# Altium schematic sheet pca10156_sheet4_level_shifters.SchDoc: =BoardTitle+' - Level Shifters'
size A3; Organization: Nordic Semiconductor; DocumentNumber: 4; SheetNumber: 4; SheetTotal: 8; CompanyName: Nordic Semiconductor; DocumentSize: A4
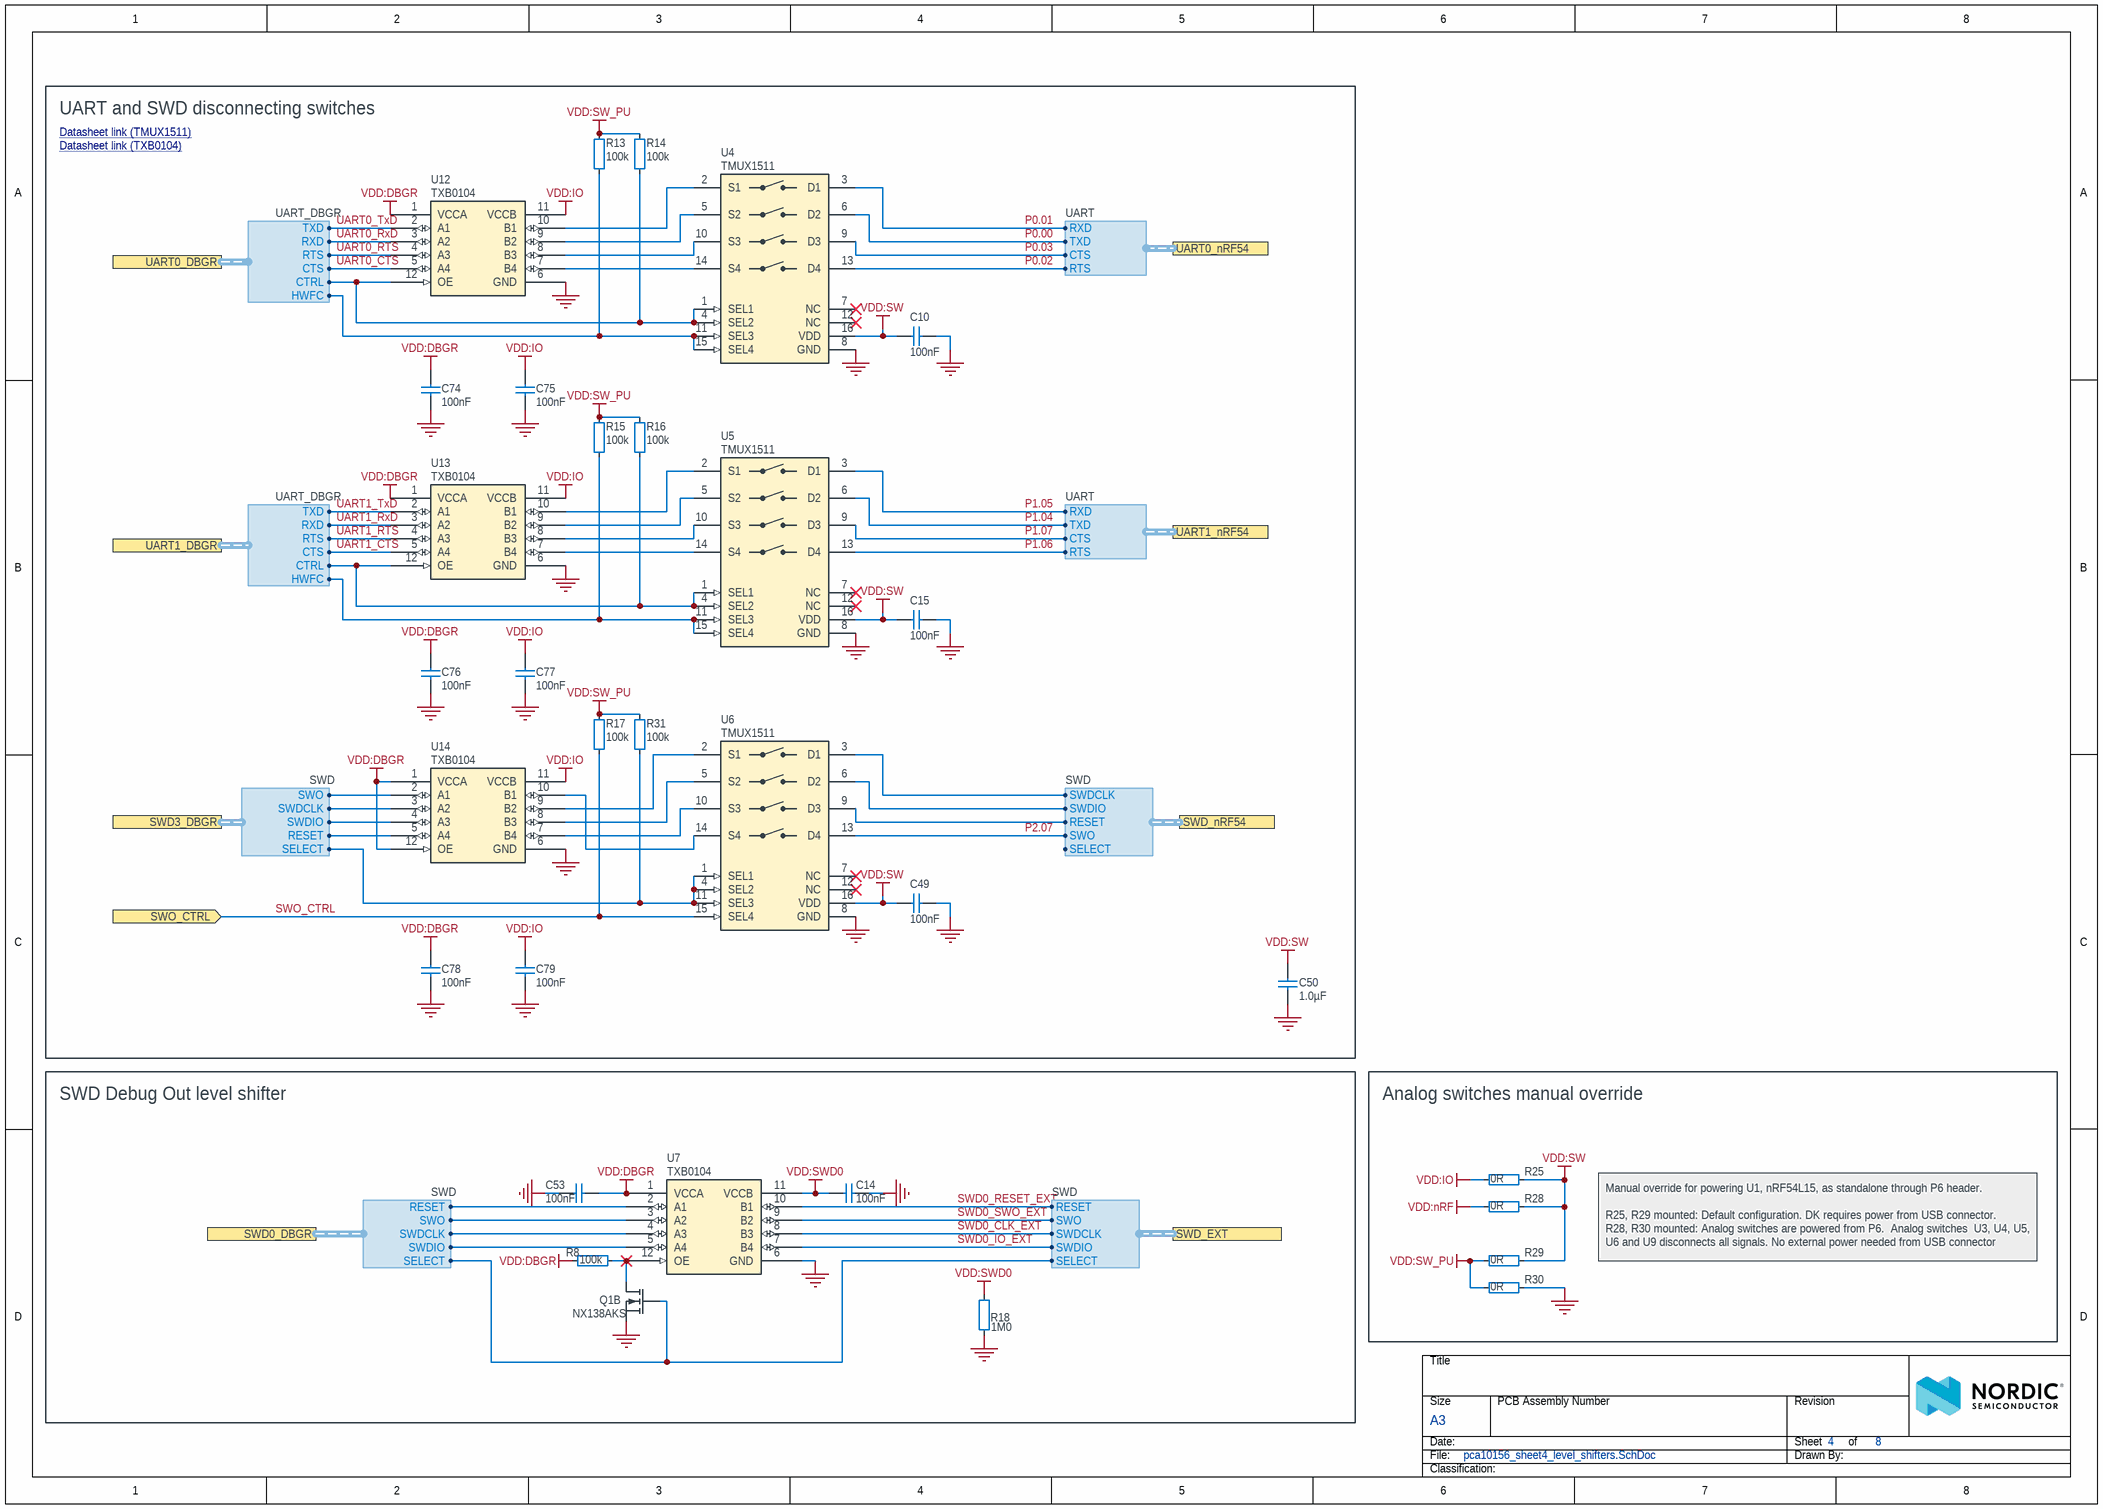
[diagram p0: pca10156_sheet4_level_shifters.SchDoc]

## Parts
C10  100nF  [CAPC0603X03L_C]
C14  100nF  [CAPC0603X03L_C]
C15  100nF  [CAPC0603X03L_C]
C49  100nF  [CAPC0603X03L_C]
C50  1.0µF  [CAPC1005X04L]
C53  100nF  [CAPC0603X03L_C]
C74  100nF  [CAPC0603X03L_C]
C75  100nF  [CAPC0603X03L_C]
C76  100nF  [CAPC0603X03L_C]
C77  100nF  [CAPC0603X03L_C]
C78  100nF  [CAPC0603X03L_C]
C79  100nF  [CAPC0603X03L_C]
Q1  NX138AKS  [TSSOP6]  (part B of 2)
R8  100k  [RESC0603X03L_C]
R13  100k  [RESC0603X03L_C]
R14  100k  [RESC0603X03L_C]
R15  100k  [RESC0603X03L_C]
R16  100k  [RESC0603X03L_C]
R17  100k  [RESC0603X03L_C]
R18  1M0  [RESC0603X03L_C]
R25  0R  [RESC1005X04L]
R28  0R  [RESC1005X04L]
R29  0R  [RESC1005X04L]
R30  0R  [RESC1005X04L]
R31  100k  [RESC0603X03L_C]
U4  TMUX1511  [XQFN40P180X260X50-16N]
U5  TMUX1511  [XQFN40P180X260X50-16N]
U6  TMUX1511  [XQFN40P180X260X50-16N]
U7  TXB0104  [QFN12P40_170X200X55L50X20]
U12  TXB0104  [QFN12P40_170X200X55L50X20]
U13  TXB0104  [QFN12P40_170X200X55L50X20]
U14  TXB0104  [QFN12P40_170X200X55L50X20]

## Blocks framed on the sheet
UART and SWD disconnecting switches: C10 C15 C49 C50 C74-C79 R13-R17 R31 U4-U6 U12-U14
SWD Debug Out level shifter: C14 C53 Q1 R8 R18 U7
Analog switches manual override: R25 R28-R30

## Ports
SWD0_DBGR (harness SWD), SWD3_DBGR (harness SWD), SWD_EXT (harness SWD), SWD_nRF54 (harness SWD), SWO_CTRL (in), UART0_DBGR (harness UART_DBGR), UART0_nRF54 (harness UART), UART1_DBGR (harness UART_DBGR), UART1_nRF54 (harness UART)

## Harnesses
SWD: SWDIO, SWDCLK, SWO, RESET, SELECT
UART: RTS, CTS, RXD, TXD
UART_DBGR: RTS, CTS, RXD, TXD, HWFC, CTRL

## Nets
GND: C10.2 C14.2 C15.2 C49.2 C50.1 C53.1 C74.2 C75.2 C76.2 C77.2 C78.2 C79.2 Q1.4(S2) R18.1 R30.2 U4.8(GND) U5.8(GND) U6.8(GND) U7.6(GND) U12.6(GND) U13.6(GND) U14.6(GND)
VDD:DBGR: C53.2 C74.1 C76.1 C78.1 R8.2 U7.1(VCCA) U12.1(VCCA) U13.1(VCCA) U14.1(VCCA) U14.12(OE)
VDD:IO: C75.1 C77.1 C79.1 R25.1 U12.11(VCCB) U13.11(VCCB) U14.11(VCCB)
VDD:nRF: R28.1
VDD:SW: C10.1 C15.1 C49.1 C50.2 R25.2 R28.2 R29.2 U4.16(VDD) U5.16(VDD) U6.16(VDD)
VDD:SW_PU: R13.1 R14.1 R15.1 R16.1 R17.2 R29.1 R30.1 R31.1
VDD:SWD0: C14.1 R18.2 U7.11(VCCB)
P0.00: U4.6(D2) ; port UART0_nRF54.TXD
P0.01: U4.3(D1) ; port UART0_nRF54.RXD
P0.02: U4.13(D4) ; port UART0_nRF54.RTS
P0.03: U4.9(D3) ; port UART0_nRF54.CTS
P1.04: U5.6(D2) ; port UART1_nRF54.TXD
P1.05: U5.3(D1) ; port UART1_nRF54.RXD
P1.06: U5.13(D4) ; port UART1_nRF54.RTS
P1.07: U5.9(D3) ; port UART1_nRF54.CTS
P2.07: U6.13(D4) ; port SWD_nRF54.SWO
SWD0_CLK_EXT: U7.8(B3) ; port SWD_EXT.SWDCLK
SWD0_IO_EXT: U7.7(B4) ; port SWD_EXT.SWDIO
SWD0_RESET_EXT: U7.10(B1) ; port SWD_EXT.RESET
SWD0_SWO_EXT: U7.9(B2) ; port SWD_EXT.SWO
SWO_CTRL: R17.1 U6.15(SEL4) ; port SWO_CTRL
UART0_CTS: U12.5(A4) ; port UART0_DBGR.CTS
UART0_RTS: U12.4(A3) ; port UART0_DBGR.RTS
UART0_RxD: U12.3(A2) ; port UART0_DBGR.RXD
UART0_TxD: U12.2(A1) ; port UART0_DBGR.TXD
UART1_CTS: U13.5(A4) ; port UART1_DBGR.CTS
UART1_RTS: U13.4(A3) ; port UART1_DBGR.RTS
UART1_RxD: U13.3(A2) ; port UART1_DBGR.RXD
UART1_TxD: U13.2(A1) ; port UART1_DBGR.TXD
NetQ1_3: Q1.3(D2) R8.1 U7.12(OE)
NetQ1_5: Q1.5(G2) ; port SWD0_DBGR.SELECT, port SWD_EXT.SELECT
NetR13_2: R13.2 U4.11(SEL3) U4.15(SEL4) ; port UART0_DBGR.HWFC
NetR14_2: R14.2 U4.1(SEL1) U4.4(SEL2) U12.12(OE) ; port UART0_DBGR.CTRL
NetR15_2: R15.2 U5.11(SEL3) U5.15(SEL4) ; port UART1_DBGR.HWFC
NetR16_2: R16.2 U5.1(SEL1) U5.4(SEL2) U13.12(OE) ; port UART1_DBGR.CTRL
NetR31_2: R31.2 U6.1(SEL1) U6.4(SEL2) U6.11(SEL3) ; port SWD3_DBGR.SELECT
NetU4_2: U4.2(S1) U12.10(B1)
NetU4_5: U4.5(S2) U12.9(B2)
NetU4_10: U4.10(S3) U12.8(B3)
NetU4_14: U4.14(S4) U12.7(B4)
NetU5_2: U5.2(S1) U13.10(B1)
NetU5_5: U5.5(S2) U13.9(B2)
NetU5_10: U5.10(S3) U13.8(B3)
NetU5_14: U5.14(S4) U13.7(B4)
NetU6_2: U6.2(S1) U14.9(B2)
NetU6_3: U6.3(D1) ; port SWD_nRF54.SWDCLK
NetU6_5: U6.5(S2) U14.8(B3)
NetU6_6: U6.6(D2) ; port SWD_nRF54.SWDIO
NetU6_9: U6.9(D3) ; port SWD_nRF54.RESET
NetU6_10: U6.10(S3) U14.7(B4)
NetU6_14: U6.14(S4) U14.10(B1)
NetU7_2: U7.2(A1) ; port SWD0_DBGR.RESET
NetU7_3: U7.3(A2) ; port SWD0_DBGR.SWO
NetU7_4: U7.4(A3) ; port SWD0_DBGR.SWDCLK
NetU7_5: U7.5(A4) ; port SWD0_DBGR.SWDIO
NetU14_2: U14.2(A1) ; port SWD3_DBGR.SWO
NetU14_3: U14.3(A2) ; port SWD3_DBGR.SWDCLK
NetU14_4: U14.4(A3) ; port SWD3_DBGR.SWDIO
NetU14_5: U14.5(A4) ; port SWD3_DBGR.RESET

Not connected (* = marked no-connect by the designer): U4 7(NC)* 12(NC)*; U5 7(NC)* 12(NC)*; U6 7(NC)* 12(NC)*

## Notes on the sheet
- Datasheet link (TMUX1511) <https://www.ti.com/lit/ds/symlink/tmux1511.pdf?ts=1730882090102&ref_url=https%253A%252F%252Fwww.mouser.dk%252F>
- Datasheet link (TXB0104) <https://www.ti.com/lit/ds/symlink/txb0104.pdf?src-supplier=IHS+Markit>
- Manual override for powering U1, nRF54L15, as standalone through P6 header.
  R25, R29 mounted: Default configuration. DK requires power from USB connector.
  R28, R30 mounted: Analog switches are powered from P6.  Analog switches  U3, U4, U5, U6 and U9 disconnects all signals. No external power needed from USB connector
- Title
- Size
- Date:
- File:
- A3
- PCB Assembly Number
- Sheet
- Drawn By:
- Revision
- of
- Classification:

## Library data of the parts
C10 C14 C15 C49 C53 C74-C79 = C0201-100n: Capacitor, X5R, ±10%; Manufacturer: N.A.; Part number IPS: 00000001248, 00000002505; Part number Norautron: 262071862; Part number NEMS: 100200078; Pad Count: 2; Note: 16V; Component Status: Active; Part Number: C0201-100n; Value: 100nF; Footprint Doc: 0201; Component Class: Capacitors; Author: rsk; PartId: 100200078; Manufacturer Part Number: N.A.; ComponentLink1URL: N.A.; ComponentLink1Description: Datasheet; ComponentLink2URL: N.A.; ComponentLink2Description: Supplier link; HelpURL: N.A.; LatestRevisionDate: 2017-11-09; Published: 2014-11-13; Supplier 1: N.A.; Supplier Part Number 1: N.A.; Supplier 2: N.A.; Supplier Part Number 2: N.A.; Artikkelnr Noca: N.A.
C50 = C0402-1µ0-6.3V-X5R-10%: Capacitor, X5R, ±10%, 6.3V; Manufacturer: N.A.; Part number Norautron: 26207137; Part number NEMS: 100200498; Pad Count: 2; Component Status: Active; Part Number: C0402-1µ0-6.3V-X5R-10%; Manufacturer Part Number: N.A.; LatestRevisionDate: 2022-01-27; Published: 2022-01-27; Value: 1.0µF; Note: 6.3V; Artikkelnr Noca: N.A.; Footprint Doc: 0402; ComponentLink1URL: N.A.; ComponentLink1Description: Datasheet; ComponentLink2URL: N.A.; ComponentLink2Description: Supplier link; HelpURL: N.A.; Supplier 1: N.A.; Supplier Part Number 1: N.A.; Supplier 2: N.A.; Supplier Part Number 2: N.A.; Part number IPS: N.A.; Component Class: Capacitors; PartId: 100200498; Author: rubr
Q1 = NX138AKS: MOSFET 2N-CH 60V 0.17A TSSOP6 (SOT363); Manufacturer: Nexperia; Manufacturer Part Number: NX138AKSX; Part number NEMS: 101300207; Component Status: Active; Pad Count: 6; Note: N.A.; Part Number: NX138AKS; Component Class: Semiconductors; Author: stl1; ComponentLink1URL: https://assets.nexperia.com/documents/data-sheet/NX138AKS.pdf; ComponentLink1Description: Datasheet; ComponentLink2URL: N.A.; ComponentLink2Description: Supplier link; HelpURL: N.A.; LatestRevisionDate: 2023-11-20; Published: 2023-11-20; Footprint Doc: TSSOP6; Value: NX138AKS; Supplier 1: Digi-Key; Supplier Part Number 1: 1727-2732-2-ND; Supplier 2: Mouser; Supplier Part Number 2: 771-NX138AKSX; Artikkelnr Noca: N.A.; Part number IPS: N.A.; Part number Norautron: N.A.; PartId: 101300207
R8 R13-R17 R31 = R0201-100k: Resistor, ±1%, 0.05W; Manufacturer: N.A.; Part number IPS: 00000001419; Part number Norautron: 26108487; Part number NEMS: 100100080; Note: Chip Res 1%; Pad Count: 2; Component Status: Active; Part Number: R0201-100k; Manufacturer Part Number: N.A.; ComponentLink1URL: N.A.; ComponentLink1Description: Datasheet; ComponentLink2URL: N.A.; ComponentLink2Description: Supplier link; HelpURL: N.A.; Footprint Doc: 0201; LatestRevisionDate: 2014-11-13; Published: 2014-11-13; Value: 100k; Artikkelnr Noca: N.A.; Supplier 1: N.A.; Supplier Part Number 1: N.A.; Supplier 2: N.A.; Supplier Part Number 2: N.A.; Component Class: Resistors; PartId: 100100080; Author: rsk
R18 = R0201-1M0: Resistor, ±1%, 0.05W; Manufacturer: N.A.; Part number IPS: 00000001418; Part number Norautron: 26107108; Part number NEMS: 100100093; Component Status: Active; Pad Count: 2; Note: Chip Res 1%; Part Number: R0201-1M0; PartId: 100100093; Component Class: Resistors; Author: rsk; Manufacturer Part Number: N.A.; ComponentLink1URL: N.A.; ComponentLink1Description: Datasheet; ComponentLink2URL: N.A.; ComponentLink2Description: Supplier link; HelpURL: N.A.; LatestRevisionDate: 2014-11-13; Published: 2014-11-13; Footprint Doc: 0201; Value: 1M0; Supplier 1: N.A.; Supplier Part Number 1: N.A.; Supplier 2: N.A.; Supplier Part Number 2: N.A.; Artikkelnr Noca: N.A.
R25 R28-R30 = R0402-0R: Resistor, ±5%, 0.063W; Manufacturer: N.A.; Part number IPS: 00000007128; Part number NEMS: 100100109; Component Status: Active; Pad Count: 2; Note: Chip Res 5%; Artikkelnr Noca: 27049000; Part Number: R0402-0R; PartId: 100100109; Component Class: Resistors; Author: rsk; Manufacturer Part Number: N.A.; ComponentLink1URL: N.A.; ComponentLink1Description: Datasheet; ComponentLink2URL: N.A.; ComponentLink2Description: Supplier link; HelpURL: N.A.; LatestRevisionDate: 2009-11-23; Published: 2009-05-08; Footprint Doc: 0402; Value: 0R; Supplier 1: Farnell; Supplier Part Number 1: 146-9661; Supplier 2: N.A.; Supplier Part Number 2: N.A.; Part number Norautron: N.A.
U4-U6 = TMUX1511: Low-Capacitance, 1:1 (SPST) 4-Channel, analog switch; Manufacturer: Texas Instruments; Manufacturer Part Number: TMUX1511RSVR; Part number NEMS: 101900847; Component Status: Active; Pad Count: 16; Note: N.A.; Part Number: TMUX1511; Component Class: Misc_ICs; Author: stl1; ComponentLink1URL: https://www.ti.com/lit/ds/symlink/tmux1511.pdf?ts=1730882090102&ref_url=https%253A%252F%252Fwww.mouser.dk%252F; ComponentLink1Description: Datasheet; ComponentLink2URL: N.A.; ComponentLink2Description: Supplier link; HelpURL: https://www.ti.com/lit/ds/symlink/tmux1511.pdf?ts=1730882090102&ref_url=https%253A%252F%252Fwww.mouser.dk%252F; LatestRevisionDate: 2024-12-05; Published: 2024-12-05; Footprint Doc: UFQFN-16; Value: TMUX1511; Supplier 1: Digi-Key; Supplier Part Number 1: 296-53443-2-ND; Supplier 2: Mouser; Supplier Part Number 2: 595-TMUX1511RSVR; Artikkelnr Noca: N.A.; Part number IPS: N.A.; Part number Norautron: N.A.; PartId: 101900847
U7 U12-U14 = TXB0104RUTR: 4-Bit Bidirectional Level-Shifter/Voltage Translator with Automatic Direction Sensing; Manufacturer: Texas Instruments; Part number NEMS: 101900856; Component Status: Active; Pad Count: 12; Note: Translator, Bidirectional; Artikkelnr Noca: N.A.; Part Number: TXB0104RUTR; Component Class: Misc_ICs; Author: stl1; Manufacturer Part Number: TXB0104RUTR; ComponentLink1URL: N.A.; ComponentLink1Description: Datasheet; ComponentLink2URL: N.A.; ComponentLink2Description: Supplier link; HelpURL: https://www.ti.com/lit/ds/symlink/txb0104.pdf?ts=1738584719537&ref_url=https%253A%252F%252Fwww.mouser.com%252F; LatestRevisionDate: 2025-02-04; Published: 2025-02-04; Footprint Doc: 12-UFQFN; Value: TXB0104; Supplier 1: Digi-Key; Supplier Part Number 1: 296-25888-2-ND; Supplier 2: Mouser; Supplier Part Number 2: 595-TXB0104RUTR; Part number IPS: N.A.; Part number Norautron: N.A.; PartId: 101900856